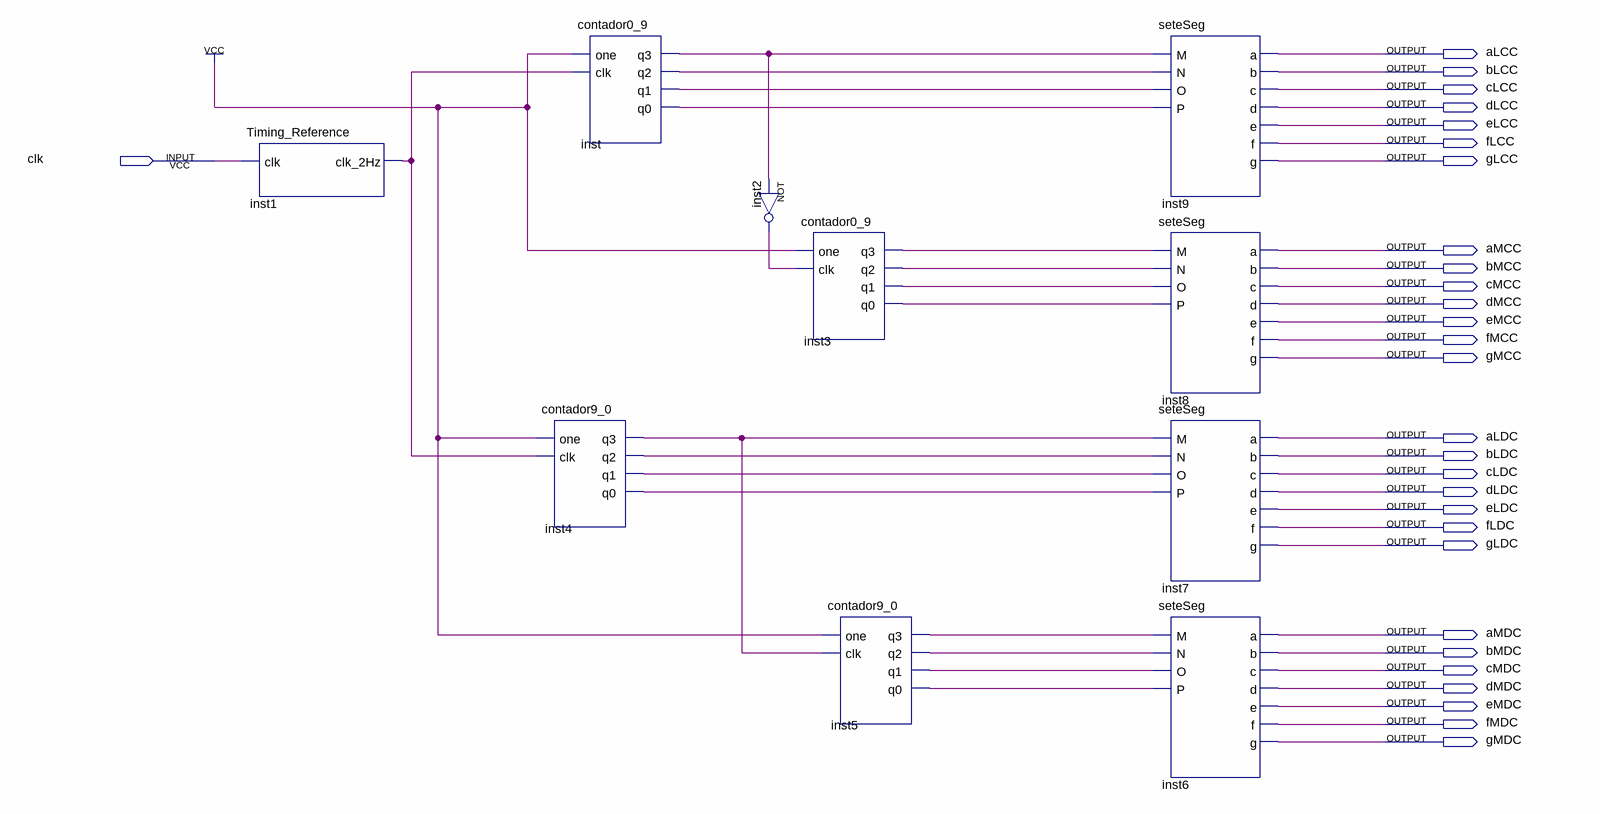
[diagram p0: schematic sheet]
// Quartus schematic lab2.bdf as structural Verilog: 10 symbols, 29 pins
module lab2 (
  input  clk,
  output aLCC,
  output bLCC,
  output cLCC,
  output dLCC,
  output eLCC,
  output fLCC,
  output gLCC,
  output aMCC,
  output bMCC,
  output cMCC,
  output dMCC,
  output eMCC,
  output fMCC,
  output gMCC,
  output aLDC,
  output bLDC,
  output cLDC,
  output dLDC,
  output eLDC,
  output fLDC,
  output gLDC,
  output aMDC,
  output bMDC,
  output cMDC,
  output dMDC,
  output eMDC,
  output fMDC,
  output gMDC
);

  wire inst1_clk_2hz, inst2_out, inst3_q0, inst3_q1, inst3_q2, inst3_q3, inst4_q0, inst4_q1, inst4_q2,
       inst4_q3, inst5_q0, inst5_q1, inst5_q2, inst5_q3, inst_q0, inst_q1, inst_q2, inst_q3;

  Timing_Reference inst1 (.clk(clk), .clk_2Hz(inst1_clk_2hz));
  contador9_0 inst4 (.one(1'b1), .clk(inst1_clk_2hz), .q3(inst4_q3), .q2(inst4_q2), .q1(inst4_q1), .q0(inst4_q0));
  contador0_9 inst (.one(1'b1), .clk(inst1_clk_2hz), .q3(inst_q3), .q2(inst_q2), .q1(inst_q1), .q0(inst_q0));
  not inst2 (inst2_out, inst_q3);
  contador0_9 inst3 (.one(1'b1), .clk(inst2_out), .q3(inst3_q3), .q2(inst3_q2), .q1(inst3_q1), .q0(inst3_q0));
  contador9_0 inst5 (.one(1'b1), .clk(inst4_q3), .q3(inst5_q3), .q2(inst5_q2), .q1(inst5_q1), .q0(inst5_q0));
  seteSeg inst9 (
    .M(inst_q3), .N(inst_q2), .O(inst_q1), .P(inst_q0), .a(aLCC), .b(bLCC), .c(cLCC), .d(dLCC), .e(eLCC),
    .f(fLCC), .g(gLCC));
  seteSeg inst8 (
    .M(inst3_q3), .N(inst3_q2), .O(inst3_q1), .P(inst3_q0), .a(aMCC), .b(bMCC), .c(cMCC), .d(dMCC), .e(eMCC),
    .f(fMCC), .g(gMCC));
  seteSeg inst7 (
    .M(inst4_q3), .N(inst4_q2), .O(inst4_q1), .P(inst4_q0), .a(aLDC), .b(bLDC), .c(cLDC), .d(dLDC), .e(eLDC),
    .f(fLDC), .g(gLDC));
  seteSeg inst6 (
    .M(inst5_q3), .N(inst5_q2), .O(inst5_q1), .P(inst5_q0), .a(aMDC), .b(bMDC), .c(cMDC), .d(dMDC), .e(eMDC),
    .f(fMDC), .g(gMDC));
endmodule
